# Altium schematic sheet Pag3_Front_end_adc_dac.SchDoc
size A4
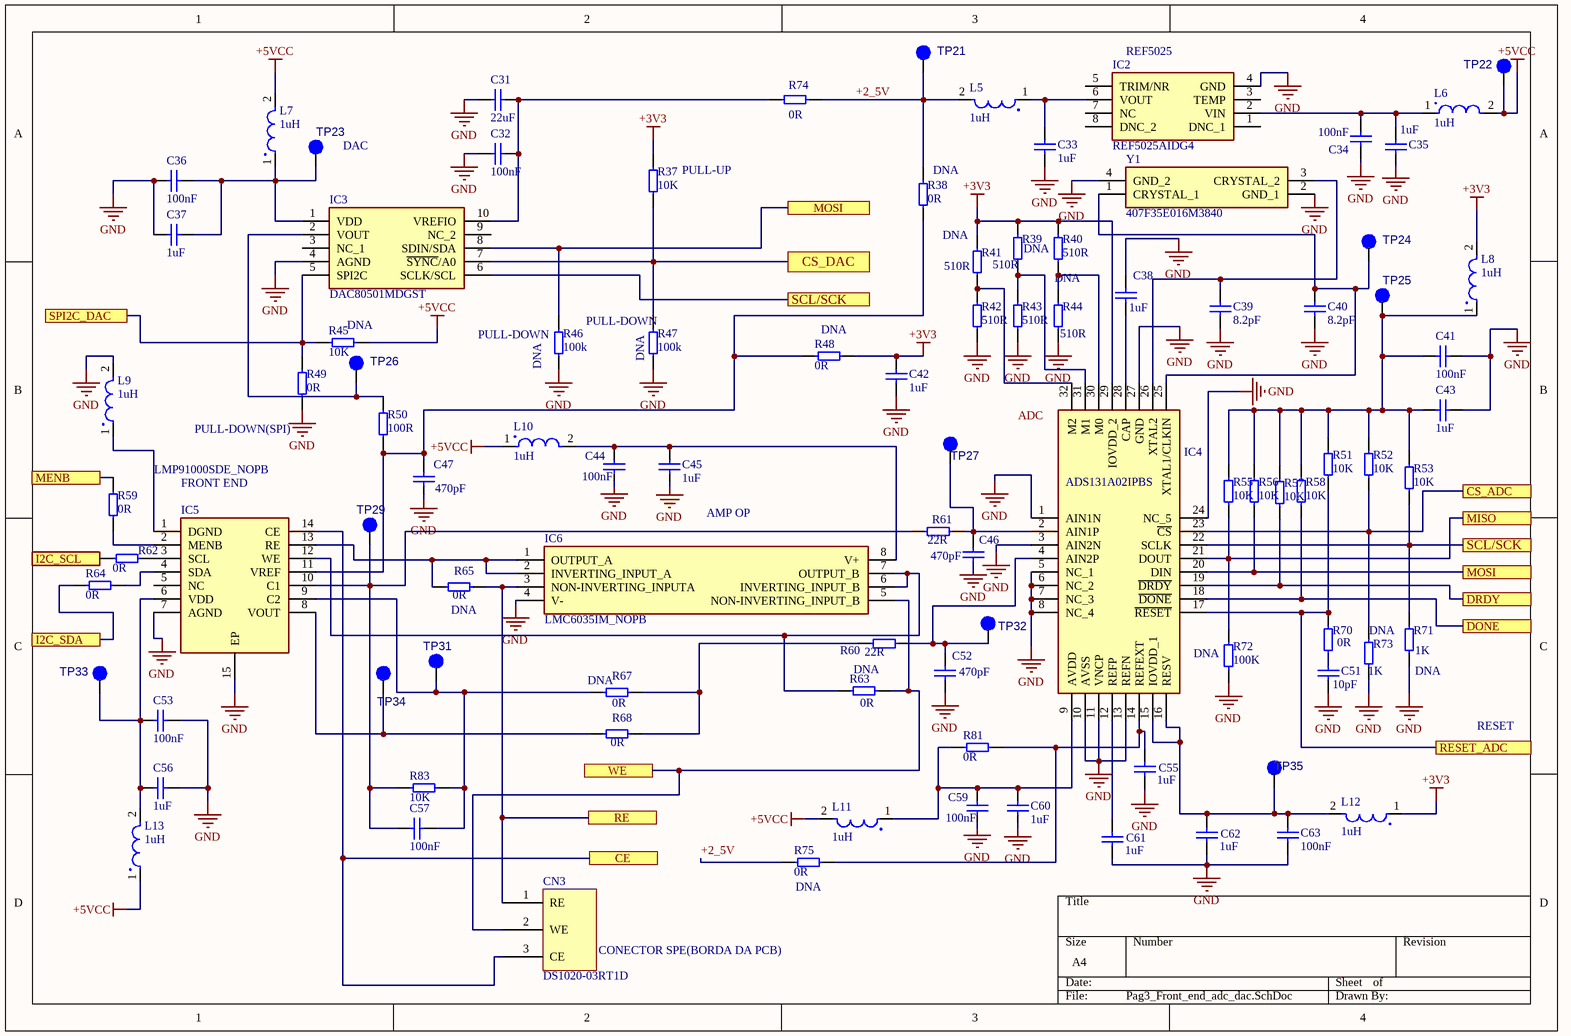
[diagram p0: Pag3_Front_end_adc_dac.SchDoc]

## Parts
C31  22uF  [0603]
C32  100nF  [0603]
C33  1uF  [0603]
C34  100nF  [0603]
C35  1uF  [0603]
C36  100nF  [0603]
C37  1uF  [0603]
C38  1uF  [0603]
C39  8.2pF  [0603]
C40  8.2pF  [0603]
C41  100nF  [0603]
C42  1uF  [0603]
C43  1uF  [0603]
C44  100nF  [0603]
C45  1uF  [0603]
C46  470pF  [0603]
C47  470pF  [0603]
C51  10pF  [0603]
C52  470pF  [0603]
C53  100nF  [0603]
C55  1uF  [0603]
C56  1uF  [0603]
C57  100nF  [0603]
C59  100nF  [0603]
C60  1uF  [0603]
C61  1uF  [0603]
C62  1uF  [0603]
C63  100nF  [0603]
CN3  DS1020-03RT1D  [DS1020-03RT1D]
IC2  REF5025AIDG4  [SOIC127P600X175-8N]
IC3  DAC80501MDGST  [SOP50P490X110-10N]
IC4  ADS131A02IPBS  [QFP50P700X700X120-32N]
IC5  LMP91000SDE_NOPB  [SON50P400X400X80-15N]
IC6  LMC6035IM_NOPB  [SOIC127P600X175-8N]
L5  1uH  [SRP4012TA]
L6  1uH  [SRP4012TA]
L7  1uH  [SRP4012TA]
L8  1uH  [SRP4012TA]
L9  1uH  [SRP4012TA]
L10  1uH  [SRP4012TA]
L11  1uH  [SRP4012TA]
L12  1uH  [SRP4012TA]
L13  1uH  [SRP4012TA]
R37  10K  [0603]
R38  0R  PCBA: DNA  [0603]
R39  PCBA: DNA  [0603]  (hidden comment: 510R)
R40  510R  [0603]
R41  510R  PCBA: DNA  [0603]
R42  510R  [0603]
R43  510R  [0603]
R44  PCBA: DNA  [0603]  (hidden comment: 510R)
R45  10K  PCBA: DNA  [0603]
R46  100k  [0603]
R47  100k  [0603]
R48  0R  PCBA: DNA  [0603]
R49  0R  [0603]
R50  100R  [0603]
R51  10K  [0603]
R52  10K  [0603]
R53  10K  [0603]
R55  10K  [0603]
R56  10K  [0603]
R57  10K  [0603]
R58  10K  [0603]
R59  0R  [0603]
R60  22R  [0603]
R61  22R  [0603]
R62  0R  [0603]
R63  0R  PCBA: DNA  [0603]
R64  0R  [0603]
R65  0R  PCBA: DNA  [0603]
R67  0R  PCBA: DNA  [0603]
R68  0R  [0603]
R70  0R  [0603]
R71  PCBA: DNA  [0603]  (hidden comment: 1K)
R72  100K  PCBA: DNA  [0603]
R73  PCBA: DNA  [0603]  (hidden comment: 1K)
R74  0R  [0603]
R75  0R  PCBA: DNA  [0603]
R81  0R  [0603]
R83  10K  [0603]
TP21  Test Point  [TEST]  (value not drawn)
TP22  Test Point  [TEST]  (value not drawn)
TP23  Test Point  [TEST]  (value not drawn)
TP24  Test Point  [TEST]  (value not drawn)
TP25  Test Point  [TEST]  (value not drawn)
TP26  Test Point  [TEST]  (value not drawn)
TP27  Test Point  [TEST]  (value not drawn)
TP29  Test Point  [TEST]  (value not drawn)
TP31  Test Point  [TEST]  (value not drawn)
TP32  Test Point  [TEST]  (value not drawn)
TP33  Test Point  [TEST]  (value not drawn)
TP34  Test Point  [TEST]  (value not drawn)
TP35  Test Point  [TEST]  (value not drawn)
Y1  407F35E016M3840  [407F35E016M3840]

## Ports
CE, CS_ADC, CS_DAC, DONE, DRDY, I2C_SCL, I2C_SDA, MENB, MISO, MOSI, RE, RESET_ADC, SCL/SCK, SPI2C_DAC, WE

## Nets
+3V3: C42.2 IC4.29(IOVDD_2) L8.2 L12.1 R37.2 R39.2 R40.2 R41.2 R48.2
+5VCC: L6.2 L7.2 L10.1 L11.2 L13.1 R45.1 TP22.1(TP)
GND: C31.1 C32.2 C33.1 C34.1 C35.1 C36.1 C37.2 C38.2 C39.1 C40.1 C41.2 C42.1 C43.1 C44.1 C45.2 C46.1 C47.1 C51.1 C52.1 C53.2 C55.1 C56.1 C59.1 C60.1 C61.1 C62.1 C63.1 IC2.4(GND) IC3.4(AGND) IC4.1(AIN1N) IC4.3(AIN2N) IC4.5(NC_1) IC4.6(NC_2) IC4.7(NC_3) IC4.8(NC_4) IC4.10(AVSS) IC4.11(VNCP) IC4.13(REFN) IC4.24(NC_5) IC4.27(GND) IC5.7(AGND) IC5.15(EP) IC6.4(V-) L9.2 R42.1 R43.1 R44.1 R46.1 R47.1 R49.1 R71.1 R72.1 R73.1 Y1.2(GND_1) Y1.4(GND_2)
+2_5V: L5.2 R38.2 R74.1 R75.2 TP21.1(TP)
CE: CN3.3(CE) IC5.14(CE) ; port CE
CS_ADC: IC4.23(~{CS}) R52.1 R73.2 ; port CS_ADC
CS_DAC: IC3.7(~{SYNC}/A0) R37.1 R47.2 ; port CS_DAC
DONE: IC4.18(~{DONE}) R58.1 ; port DONE
DRDY: IC4.19(~{DRDY}) R57.1 ; port DRDY
I2C_SCL: R62.2 ; port I2C_SCL
I2C_SDA: R64.2 ; port I2C_SDA
MENB: R59.2 ; port MENB
MISO: IC4.21(DOUT) R55.1 R72.2 ; port MISO
MOSI: IC3.8(SDIN/SDA) IC4.20(DIN) R46.2 R56.1 ; port MOSI
RE: CN3.1(RE) IC6.3(NON-INVERTING_INPUTA) R65.1 ; port RE
RESET_ADC: IC4.17(~{RESET}) R51.1 R70.2 ; port RESET_ADC
SCL/SCK: IC3.6(SCLK/SCL) IC4.22(SCLK) R53.1 R71.2 ; port SCL/SCK
SPI2C_DAC: IC3.5(SPI2C) R45.2 R49.2 ; port SPI2C_DAC
WE: CN3.2(WE) IC6.5(NON-INVERTING_INPUT_B) R63.1 ; port WE
NetC31_2: C31.2 C32.1 IC3.10(VREFIO) R74.2
NetC33_2: C33.2 IC2.6(VOUT) L5.1
NetC34_2: C34.2 C35.2 IC2.2(VIN) L6.1
NetC36_2: C36.2 C37.1 IC3.1(VDD) L7.1 TP23.1(TP)
NetC38_1: C38.1 IC4.28(CAP)
NetC39_2: C39.2 IC4.26(XTAL2) Y1.3(CRYSTAL_2)
NetC40_2: C40.2 IC4.25(XTAL1/CLKIN) TP24.1(TP) Y1.1(CRYSTAL_1)
NetC41_1: C41.1 C43.2 L8.1 R51.2 R52.2 R53.2 R55.2 R56.2 R57.2 R58.2 TP25.1(TP)
NetC44_2: C44.2 C45.1 IC6.8(V+) L10.2
NetC46_2: C46.2 IC4.2(AIN1P) R61.2 TP27.1(TP)
NetC47_2: C47.2 IC5.11(VREF) R38.1 R48.1 R50.1
NetC51_2: C51.2 R70.1
NetC52_2: C52.2 IC4.4(AIN2P) R60.2 TP32.1(TP)
NetC53_1: C53.1 C56.2 IC5.6(VDD) L13.2 TP33.1(TP)
NetC55_2: C55.2 IC4.14(REFEXT) R75.1 R81.1
NetC57_1: C57.1 IC5.10(C1) R61.1 R83.2 TP29.1(TP)
NetC57_2: C57.2 IC5.9(C2) R67.2 R83.1 TP31.1(TP)
NetC59_2: C59.2 C60.2 IC4.9(AVDD) L11.1 R81.2
NetC61_2: C61.2 IC4.12(REFP)
NetC62_2: C62.2 C63.2 IC4.15(IOVDD_1) IC4.16(RESV) L12.2 TP35.1(TP)
NetIC3_2: IC3.2(VOUT) R50.2 TP26.1(TP)
NetIC4_30: IC4.30(M0) R40.1 R44.2
NetIC4_31: IC4.31(M1) R39.1 R43.2
NetIC4_32: IC4.32(M2) R41.1 R42.2
NetIC5_1: IC5.1(DGND) L9.1
NetIC5_2: IC5.2(MENB) R59.1
NetIC5_3: IC5.3(SCL) R62.1
NetIC5_4: IC5.4(SDA) R64.1
NetIC5_8: IC5.8(VOUT) R68.2 TP34.1(TP)
NetIC5_12: IC5.12(WE) IC6.6(INVERTING_INPUT_B) IC6.7(OUTPUT_B) R63.2
NetIC5_13: IC5.13(RE) IC6.1(OUTPUT_A) IC6.2(INVERTING_INPUT_A) R65.2
NetR60_1: R60.1 R67.1 R68.1

Not connected (* = marked no-connect by the designer): IC2 1(DNC_1) 3(TEMP) 5(TRIM/NR) 7(NC) 8(DNC_2); IC3 3(NC_1) 9(NC_2); IC5 5(NC)

## Notes on the sheet
- (near IC2) REF5025
- (near TP23) DAC
- (near R37) PULL-UP
- (near R46) PULL-DOWN
- (near R46) DNA
- (near R47) PULL-DOWN
- (near R47) DNA
- (near R49) PULL-DOWN(SPI)
- (near IC5) FRONT END
- AMP OP
- RESET
- CONECTOR SPE(BORDA DA PCB)
- Labels drawn without touching a wire or pin: ADC

## Library data of the parts
C31 = CAP_10uF_10V: Multilayer Ceramic Capacitors MLCC - SMD/SMT 22uF 0603 6.3V 20%; Manufacturer: KEMET; MPN: C0603C226M9PACTU; PCBA: Assembly; Moeda: Dólar; NCM: 85322410; Datasheet: http://www.mouser.com/ds/2/281/c02e-2905.pdf; Value: 22uF; Link/Contato: https://octopart.com/c0603c226m9pactu-kemet-109693077?r=sp; Supplier: Mouser
C32 C34 C36 C41 C44 C53 C57 C59 C63 = Cap_1: Multilayer Ceramic Capacitors MLCC - SMD/SMT 100nF 16V 0603 10%; MPN: C0603C104K4RACTU; Manufacturer: Kemet; PCBA: Assembly; Moeda: Dólar; NCM: 85322410; Value: 100nF; Link/Contato: https://octopart.com/c0603c104k4ractu-kemet-93067?r=sp; Supplier: Mouser
C33 C35 C37 C38 C42 C43 C45 C55 C56 C60-C62 = CAP_1uF: Multilayer Ceramic Capacitors MLCC - SMD/SMT 1uF 25V 0603 10%; Manufacturer: Samsung Electro-Mechanics; MPN: CL10A105KA8NNNC; PCBA: Assembly; Moeda: Dólar; NCM: 85322410; Datasheet: https://www.mouser.com/datasheet/2/585/MLCC-1837944.pdf; Value: 1uF; Link/Contato: https://octopart.com/cl10a105ka8nnnc-samsung-9300957?r=sp; Supplier: Mouser
C39 C40 = Cap_1_1: Multilayer Ceramic Capacitors MLCC - SMD/SMT 8.2pF 0603 16V 0.25pF; MPN: C0603C829C4GACAUTO; Manufacturer: Kemet; PCBA: Assembly; Moeda: Dólar; NCM: 85322410; Value: 8.2pF; Link/Contato: https://octopart.com/c0603c829c4gacauto-kemet-108099791?r=sp; Supplier: Mouser
C46 C52 = CAP_100nF_10V: Multilayer Ceramic Capacitors MLCC - SMD/SMT 470pF 0603 25V 5%; Manufacturer: Kyocera AVX; MPN: 06033A471JAT2A; PCBA: DNA; Moeda: Dólar; NCM: 85322410; Datasheet: https://www.mouser.com/datasheet/2/212/KEM_C1023_X7R_AUTO_SMD-1093309.pdf; Value: 470pF; Link/Contato: https://octopart.com/06033a471jat2a-kyocera+avx-71036351?r=sp; Supplier: Mouser
C47 = CAP_100nF_10V: Multilayer Ceramic Capacitors MLCC - SMD/SMT 470pF 0603 25V 5%; Manufacturer: Kyocera AVX; MPN: 06033A471JAT2A; PCBA: Assembly; Moeda: Dólar; NCM: 85322410; Datasheet: https://www.mouser.com/datasheet/2/212/KEM_C1023_X7R_AUTO_SMD-1093309.pdf; Value: 470pF; Link/Contato: https://octopart.com/06033a471jat2a-kyocera+avx-71036351?r=sp; Supplier: Mouser
C51 = Cap_1_1: Multilayer Ceramic Capacitors MLCC - SMD/SMT 10pF 0603 16V 10%; MPN: 0603YD100KAT2A; Manufacturer: Kyocera AVX; PCBA: Assembly; Moeda: Dólar; NCM: 85322410; Value: 10pF; Link/Contato: https://octopart.com/0603yd100kat2a-kyocera+avx-122048797?r=sp; Supplier: Mouser
CN3 = DS1020-03RT1D: Connector: FFC/FPC; angled 90°; PIN: 3; Non-ZIF; THT; tinned; 20mΩ; Manufacturer: Connfly; PCBA: Assembly; Moeda: Dólar; NCM: 85366990; MPN: DS1020-03RT1D; Value: DS1020-03RT1D; Link/Contato: https://octopart.com/ds1020-03rt1d-connfly-30735942?r=sp; Supplier: Mouser
IC2 = REF5025AIDG4: Integrated Circuit; Manufacturer: Texas Instruments; PCBA: Assembly; Moeda: Dólar; NCM: 85423120; MPN: REF5025AIDG4; Value: REF5025AIDG4; Datasheet: https://www.ti.com/lit/ds/symlink/ref5020.pdf?HQS=TI-null-null-digikeymode-df-pf-null-wwe&ts=1600155491186; Link/Contato: https://octopart.com/ref5025aidg4-texas+instruments-7108023?r=sp; Supplier: Mouser
IC3 = DAC80501MDGST: Integrated Circuit; Manufacturer: Texas Instruments; PCBA: Assembly; Moeda: Dólar; NCM: 85423120; MPN: DAC80501MDGST; Value: DAC80501MDGST; Datasheet: https://www.ti.com/lit/gpn/DAC80501; Link/Contato: https://octopart.com/dac80501mdgst-texas+instruments-103245318?r=sp; Supplier: Mouser
IC4 = ADS131A02IPBS: Integrated Circuit; Manufacturer: Texas Instruments; PCBA: Assembly; Moeda: Dólar; NCM: 85423120; MPN: ADS131A02IPBS; Value: ADS131A02IPBS; Datasheet: http://www.ti.com/lit/gpn/ADS131A02; Link/Contato: https://octopart.com/ads131a02ipbsr-texas+instruments-75117683?r=sp; Supplier: Mouser
IC5 = LMP91000SDE_NOPB: Integrated Circuit; MPN: LMP91000SDE/NOPB; Manufacturer: Texas Instruments; PCBA: Assembly; Moeda: Dólar; NCM: 85423120; Value: LMP91000SDE_NOPB; Datasheet: http://www.ti.com/lit/ds/symlink/lmp91000.pdf; Link/Contato: https://octopart.com/lmp91000sde%2Fnopb-texas+instruments-24815749?r=sp; Supplier: Mouser
IC6 = LMC6035IM_NOPB: Integrated Circuit; Manufacturer: Texas Instruments; MPN: LMC6035IM/NOPB; Value: LMC6035IM/NOPB; PCBA: DNA; Moeda: Dólar; NCM: 85423120; Datasheet: http://www.ti.com/lit/ds/symlink/lmc6035.pdf; Link/Contato: https://octopart.com/lmc6035imx%2Fnopb-texas+instruments-24815243?r=sp; Supplier: Mouser
L5-L9 L11-L13 = IC_1uH: Power Inductors - SMD 1uH 20% SMD 4012 AEC-Q200; Manufacturer: Bourns; MPN: SRP4012TA-1R0M; PCBA: Assembly; Value: 1uH 20%; Moeda: Dólar; NCM: 85045000; Datasheet: https://www.mouser.com/datasheet/2/54/rp4012ta-1391620.pdf; Link/Contato: https://octopart.com/srp4012ta-1r0m-bourns-47284976?r=sp; Supplier: Mouser
L10 = IC_1uH: Power Inductors - SMD 1uH 20% SMD 4012 AEC-Q200; Manufacturer: Bourns; MPN: SRP4012TA-1R0M; PCBA: DNA; Value: 1uH 20%; Moeda: Dólar; NCM: 85045000; Datasheet: https://www.mouser.com/datasheet/2/54/rp4012ta-1391620.pdf; Link/Contato: https://octopart.com/srp4012ta-1r0m-bourns-47284976?r=sp; Supplier: Mouser
R37 R51 R52 R55-R58 = Pullup_Res_100K_0603_RES: Thick Film Resistors - SMD 10 kOhms 100-200 mW 0603 1%; MPN: RC0603FR-1310KL; Manufacturer: Yageo; PCBA: Assembly; Moeda: Dólar; NCM: 85332120; Datasheet: https://www.mouser.com/datasheet/2/427/crcwce3-1223726.pdf; Value: 10K; Link/Contato: https://octopart.com/rc0603fr-1310kl-yageo-11543875?r=sp; Supplier: Mouser
R38 R48 = Pullup_Res_100K_0603_RES: Thick Film Resistors - SMD 0 Ohms 100 mW 0603 5%; MPN: RC0603JR-070RL; Manufacturer: Yageo; Moeda: Dólar; NCM: 85332120; Datasheet: https://www.mouser.com/datasheet/2/447/PYu-RC_Group_51_RoHS_L_10-1527934.pdf; Value: 0R; Link/Contato: https://octopart.com/rc0603jr-070rl-yageo-1241539?r=sp; Supplier: Mouser
R39 R41 R44 = Pullup_Res_0_0603_RES: Thick Film Resistors - SMD 510 Ohms 0603 100mW 1%; MPN: RC0603FR-13510RL; Manufacturer: Yageo; Moeda: Dólar; NCM: 85332120; Datasheet: https://www.mouser.com/datasheet/2/447/PYu-RC_Group_51_RoHS_L_10-1527934.pdf; Value: 510R; Link/Contato: https://octopart.com/rc0603fr-13510rl-yageo-26129952?r=sp; Supplier: Mouser
R40 R42 R43 = Pullup_Res_0_0603_RES: Thick Film Resistors - SMD 510 Ohms 0603 100mW 1%; MPN: RC0603FR-13510RL; Manufacturer: Yageo; PCBA: Assembly; Moeda: Dólar; NCM: 85332120; Datasheet: https://www.mouser.com/datasheet/2/447/PYu-RC_Group_51_RoHS_L_10-1527934.pdf; Value: 510R; Link/Contato: https://octopart.com/rc0603fr-13510rl-yageo-26129952?r=sp; Supplier: Mouser
R45 = Pullup_Res_100K_0603_RES: Thick Film Resistors - SMD 10 kOhms 100-200 mW 0603 1%; MPN: RC0603FR-1310KL; Manufacturer: Yageo; Moeda: Dólar; NCM: 85332120; Datasheet: https://www.mouser.com/datasheet/2/427/crcwce3-1223726.pdf; Value: 10K; Link/Contato: https://octopart.com/rc0603fr-1310kl-yageo-11543875?r=sp; Supplier: Mouser
R46 R47 = Pullup_Res_100K_0603_RES: Thick Film Resistors - SMD 100 kOhms 0603 100mW 1%; MPN: RC0603FR-07100KL; Manufacturer: Yageo; PCBA: DNA; Moeda: Dólar; NCM: 85332120; Datasheet: https://www.mouser.com/datasheet/2/447/PYu-RC_Group_51_RoHS_L_10-1527934.pdf; Value: 100k; Link/Contato: https://octopart.com/rc0603fr-07100kl-yageo-40946036?r=sp; Supplier: Mouser
R49 R59 R62 R64 R68 R70 R74 R81 = Pullup_Res_0_0603_RES: Thick Film Resistors - SMD 0 Ohms 100 mW 0603 5%; MPN: RC0603JR-070RL; Manufacturer: Yageo; PCBA: Assembly; Moeda: Dólar; NCM: 85332120; Datasheet: https://www.mouser.com/datasheet/2/447/PYu-RC_Group_51_RoHS_L_10-1527934.pdf; Value: 0R; Link/Contato: https://octopart.com/rc0603jr-070rl-yageo-1241539?r=sp; Supplier: Mouser
R50 = Pullup_Res_0_0603_RES: Thick Film Resistors - SMD 100 Ohms 0603 100mW 1%; MPN: ERJ-3EKF1000V; Manufacturer: Panasonic; PCBA: Assembly; Moeda: Dólar; NCM: 85332120; Value: 100R; Link/Contato: https://octopart.com/erj-3ekf1000v-panasonic-55403645?r=sp; Supplier: Mouser
R53 R83 = Pullup_Res_100K_0603_RES: Thick Film Resistors - SMD 10 kOhms 100-200 mW 0603 1%; MPN: RC0603FR-1310KL; Manufacturer: Yageo; PCBA: DNA; Moeda: Dólar; NCM: 85332120; Datasheet: https://www.mouser.com/datasheet/2/427/crcwce3-1223726.pdf; Value: 10K; Link/Contato: https://octopart.com/rc0603fr-1310kl-yageo-11543875?r=sp; Supplier: Mouser
R60 R61 = Res_3: Thin Film Resistors - SMD 22Ohms 0603 100mW 1%; MPN: RT0603FRE0722RL; Manufacturer: Yageo; PCBA: Assembly; Moeda: Dólar; NCM: 85332120; Value: 22R; Link/Contato: https://octopart.com/rt0603fre0722rl-yageo-39814074?r=sp; Supplier: Mouser
R63 R65 R67 R75 = Pullup_Res_0_0603_RES: Thick Film Resistors - SMD 0 Ohms 100 mW 0603 5%; MPN: RC0603JR-070RL; Manufacturer: Yageo; Moeda: Dólar; NCM: 85332120; Datasheet: https://www.mouser.com/datasheet/2/447/PYu-RC_Group_51_RoHS_L_10-1527934.pdf; Value: 0R; Link/Contato: https://octopart.com/rc0603jr-070rl-yageo-1241539?r=sp; Supplier: Mouser
R71 R73 = Res: Thick Film Resistors - SMD 1 kOhms 100 mW 0603 5%; Manufacturer: Yageo; MPN: RC0603JR-071KL; Moeda: Dólar; NCM: 85332120; Datasheet: https://www.mouser.com/datasheet/2/447/PYu-RT_1-to-0.01_RoHS_L_9-1222720.pdf; Value: 1K; Link/Contato: https://octopart.com/rc0603jr-071kl-yageo-55402888?r=sp; Supplier: Mouser
R72 = Pullup_Res_100K_0603_RES: Thick Film Resistors - SMD 100 kOhms 0603 100mW 1%; MPN: RC0603FR-07100KL; Manufacturer: Yageo; Moeda: Dólar; NCM: 85332120; Datasheet: https://www.mouser.com/datasheet/2/447/PYu-RC_Group_51_RoHS_L_10-1527934.pdf; Value: 100K; Link/Contato: https://octopart.com/rc0603fr-07100kl-yageo-40946036?r=sp; Supplier: Mouser
TP21-TP27 TP29 TP31-TP35 = TESTPOINT: MPN: Test_Point; Manufacturer: DNA; PCBA: DNA; Value: Test Point
Y1 = 407F35E016M3840: Crystal or Oscillator; Manufacturer: CTS Electronic Components; PCBA: Assembly; Moeda: Dólar; NCM: 85416010; Value: 407F35E016M3840; MPN: 407F35E016M3840; Datasheet: http://www.ctscorp.com/wp-content/uploads/407.pdf; Link/Contato: https://octopart.com/407f35e016m3840-cts+components-2428554?r=sp; Supplier: Mouser